# Altium project Discharge.PrjPcb
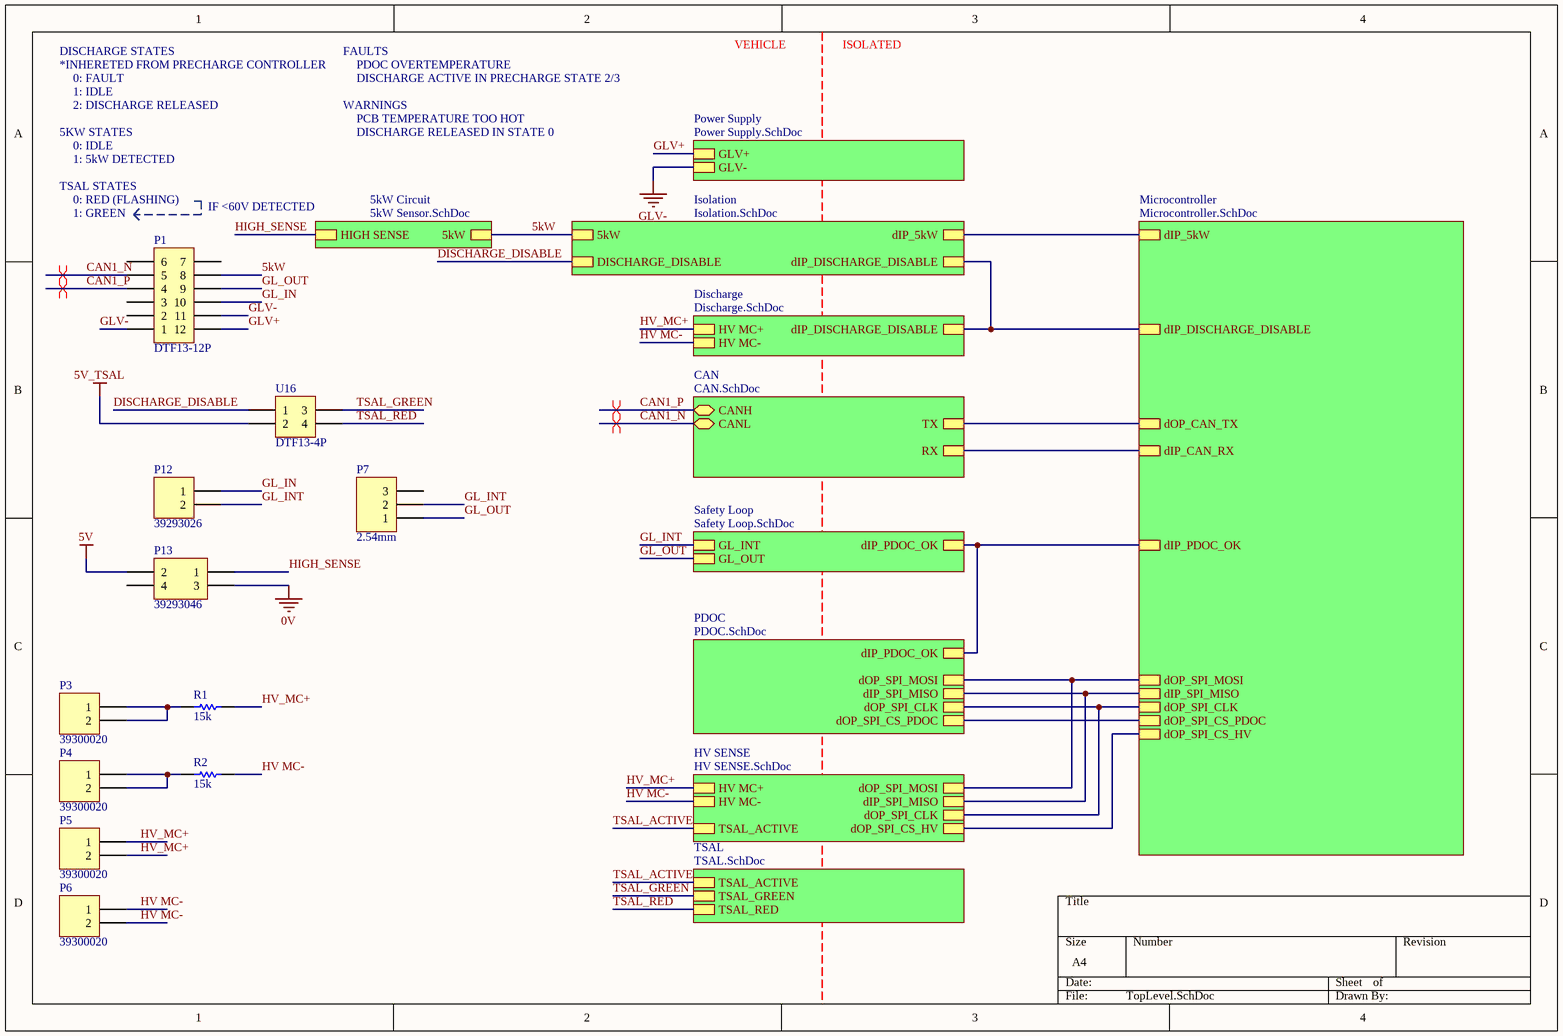
[diagram p0: TopLevel.SchDoc]
6 sheets, 90 parts. Net scope: hierarchical (ports join the sheet entries above them; power ports are global).
Board files: Discharge_B2.PcbDoc, Discharge_B3.PcbDoc, Discharge_B5.PcbDoc, Discharge_B4.PcbDoc, Discharge_C1.PcbDoc
Sheets:
  TopLevel.SchDoc
    Safety Loop = Safety Loop.SchDoc
    Discharge = Discharge.SchDoc
    PDOC = PDOC.SchDoc
    HV SENSE = HV Sense.SchDoc
    TSAL = TSAL.SchDoc

## Sheet TopLevel.SchDoc
size A4; SheetNumber: 1; SheetTotal: 11

### Parts
P1  DTF13-12P  [DTF13-12P]
P3  39300020  [39300020]
P4  39300020  [39300020]
P5  39300020  [39300020]
P6  39300020  [39300020]
P7  2.54mm  [TH 2.54mm Header 1x3]
P12  39293026  [39293026]
P13  39293046  [39293046]
R1  15k  [TE_SMF7]
R2  15k  [TE_SMF7]
U16  DTF13-4P  [DTF13-4P]

### Sub-sheets
5kW Circuit = 5kW Sensor.SchDoc (file not in this document): 5kW, HIGH SENSE
CAN = CAN.SchDoc (file not in this document): CANH (bidir), CANL (bidir), TX, RX
Discharge = Discharge.SchDoc: dIP_DISCHARGE_DISABLE, HV MC+, HV MC-
HV SENSE = HV SENSE.SchDoc: HV MC+, HV MC-, dOP_SPI_MOSI, dIP_SPI_MISO, dOP_SPI_CLK, dOP_SPI_CS_HV, TSAL_ACTIVE
Isolation = Isolation.SchDoc (file not in this document): dIP_DISCHARGE_DISABLE, DISCHARGE_DISABLE, 5kW, dIP_5kW
Microcontroller = Microcontroller.SchDoc (file not in this document): dIP_PDOC_OK, dIP_DISCHARGE_DISABLE, dIP_5kW, dOP_CAN_TX, dIP_CAN_RX, dOP_SPI_MOSI, dIP_SPI_MISO, dOP_SPI_CLK, dOP_SPI_CS_PDOC, dOP_SPI_CS_HV
PDOC = PDOC.SchDoc: dIP_PDOC_OK, dOP_SPI_CLK, dOP_SPI_MOSI, dIP_SPI_MISO, dOP_SPI_CS_PDOC
Power Supply = Power Supply.SchDoc (file not in this document): GLV+, GLV-
Safety Loop = Safety Loop.SchDoc: GL_INT, GL_OUT, dIP_PDOC_OK
TSAL = TSAL.SchDoc: TSAL_GREEN, TSAL_RED, TSAL_ACTIVE

### Nets
0V: P13.3
5V: P13.2
5V_TSAL: U16.2
GLV-: P1.1 P1.11 ; sheet Power Supply/GLV-
HV MC-: P6.1 P6.2 R2.2 ; sheet Discharge/HV MC-, sheet HV SENSE/HV MC-
5kW: P1.8 ; sheet Isolation/5kW, sheet 5kW Circuit/5kW
CAN1_N: P1.5 ; sheet CAN/CANL
CAN1_P: P1.4 ; sheet CAN/CANH
DISCHARGE_DISABLE: U16.1 ; sheet Isolation/DISCHARGE_DISABLE
GL_IN: P1.10 P12.1
GL_INT: P7.2 P12.2 ; sheet Safety Loop/GL_INT
GL_OUT: P1.9 P7.1 ; sheet Safety Loop/GL_OUT
GLV+: P1.12 ; sheet Power Supply/GLV+
HIGH_SENSE: P13.1 ; sheet 5kW Circuit/HIGH SENSE
HV_MC+: P5.1 P5.2 R1.2 ; sheet Discharge/HV MC+, sheet HV SENSE/HV MC+  [project net HV MC +]
TSAL_ACTIVE: sheet HV SENSE/TSAL_ACTIVE, sheet TSAL/TSAL_ACTIVE
TSAL_GREEN: U16.3 ; sheet TSAL/TSAL_GREEN
TSAL_RED: U16.4 ; sheet TSAL/TSAL_RED
NetD17_K: sheet PDOC/dIP_SPI_MISO, sheet HV SENSE/dIP_SPI_MISO, sheet Microcontroller/dIP_SPI_MISO
NetP3_1: P3.1 P3.2 R1.1
NetP4_1: P4.1 P4.2 R2.1
NetR9_1: sheet Safety Loop/dIP_PDOC_OK, sheet PDOC/dIP_PDOC_OK, sheet Microcontroller/dIP_PDOC_OK
NetR11_1: sheet Isolation/dIP_DISCHARGE_DISABLE, sheet Discharge/dIP_DISCHARGE_DISABLE, sheet Microcontroller/dIP_DISCHARGE_DISABLE
NetU9_3: sheet HV SENSE/dOP_SPI_CS_HV, sheet Microcontroller/dOP_SPI_CS_HV
NetU9_4: sheet PDOC/dOP_SPI_CLK, sheet HV SENSE/dOP_SPI_CLK, sheet Microcontroller/dOP_SPI_CLK
NetU9_5: sheet PDOC/dOP_SPI_MOSI, sheet HV SENSE/dOP_SPI_MOSI, sheet Microcontroller/dOP_SPI_MOSI
NetU13_3: sheet PDOC/dOP_SPI_CS_PDOC, sheet Microcontroller/dOP_SPI_CS_PDOC
(unnamed): sheet Isolation/dIP_5kW, sheet Microcontroller/dIP_5kW
(unnamed): sheet Microcontroller/dOP_CAN_TX, sheet CAN/TX
(unnamed): sheet Microcontroller/dIP_CAN_RX, sheet CAN/RX

Not connected (* = marked no-connect by the designer): P1 2 3 6 7; P7 3; P13 4

### Layout directives
differential pair: CAN1_N, CAN1_P

### Notes on the sheet
- DISCHARGE STATES
- *INHERETED FROM PRECHARGE CONTROLLER
- 0: FAULT
- 1: IDLE
- 2: DISCHARGE RELEASED
- FAULTS
- WARNINGS
- PDOC OVERTEMPERATURE
- DISCHARGE ACTIVE IN PRECHARGE STATE 2/3
- VEHICLE
- ISOLATED
- 5KW STATES
- 1: 5kW DETECTED
- 0: IDLE
- PCB TEMPERATURE TOO HOT
- DISCHARGE RELEASED IN STATE 0
- TSAL STATES
- 0: RED (FLASHING)
- (near P1) 1: GREEN
- (near P1) IF <60V DETECTED

### Library data of the parts
P1 = DTF13-12P: Positions: 12; Pitch: 4.45mm; Angle: 90; Flange: No; Contact: Copper Alloy; Part Number: DTF13-12P; Row Spacing: 4.45mm; Digikey Part Number: 1734-1861-ND; Digikey Link: https://www.digikey.com/products/en?keywords=dtf13-12pa
P3-P6 = 39300020: Pitch: 4.2mm; Row Spacing: 5.5mm; Angle: 90; Flange: No; Contact: Tin; Part Number: 39300020; Positions: 2; Digikey Part Number: WM21351-ND
P7 = TH 2.54mm Header 1x3: Positions: 3; Angle: 0; Flange: No; Contact: NA; Part Number: TH 2.54mm Header 1x3; Pitch: 2.54mm; Row Spacing: 2.54mm
P12 = 39293026: Pitch: 4.2mm; Row Spacing: 5.5mm; Angle: 0; Flange: No; Contact: Tin; Part Number: 39293026; Positions: 2; Digikey Part Number: WM3843-ND
P13 = 39293046: Pitch: 4.2mm; Row Spacing: 5.5mm; Angle: 0; Flange: No; Contact: Tin; Part Number: 39293046; Positions: 4; Digikey Part Number: WM3844-ND
R1 R2 = SMF715KJ: Manufacturer: TE; Tolerance: 0.05; Rated Power: 7W; Part Number: SMF715KJ; Value: 15k; Material: Metal Film
U16 = DTF13-4P: Positions: 4; Pitch: 9.12mm; Row Spacing: 4.45mm; Angle: 90; Flange: Yes; Contact: Copper Alloy; Part Number: DTF13-4P; Digikey Part Number: 1734-1646-ND; Digikey Link: https://www.digikey.com.au/products/en?keywords=dtf13-4p

## Sheet Safety Loop.SchDoc
size A4; SheetNumber: 4; SheetTotal: 11
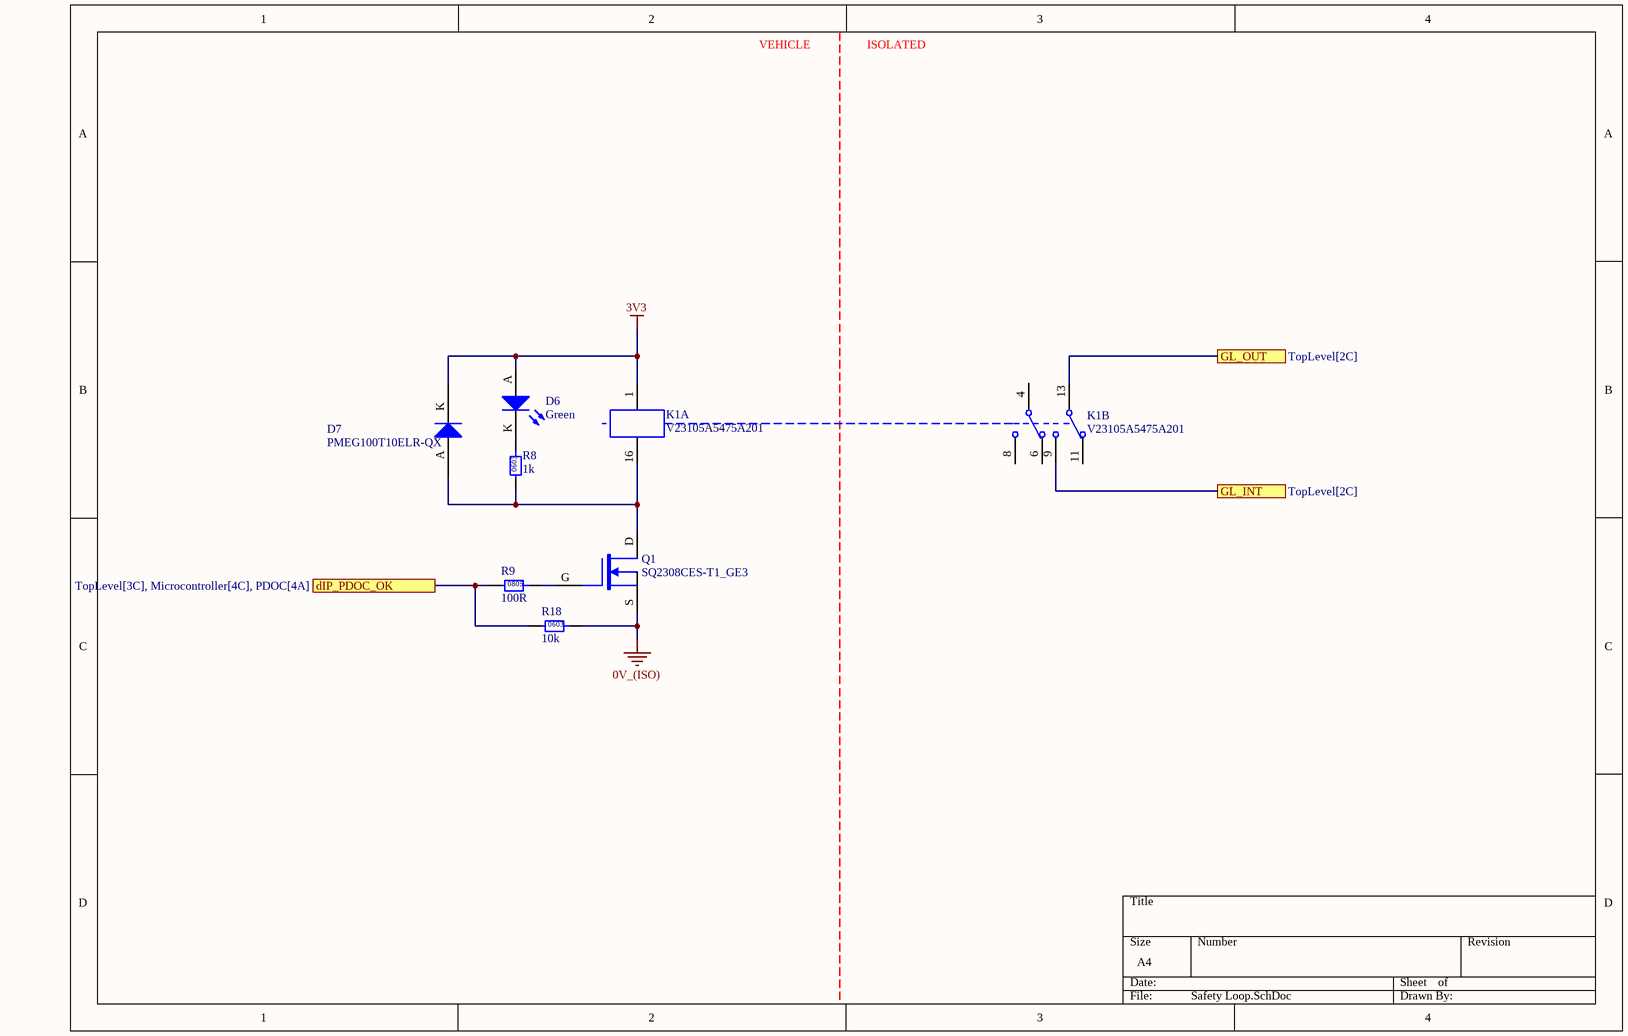
[diagram p1: Safety Loop.SchDoc]

### Parts
D6  Green  [0805 LED]
D7  PMEG100T10ELR-QX  [SODFL350X110-2N]
K1  V23105A5475A201  [TI 2-DIL]  (parts A,B of 2)
Q1  SQ2308CES-T1_GE3  [VSHY SOT-23-3]
R8  1k  [0603]
R9  100R  [0805]
R18  10k  [0603]

### Ports
dIP_PDOC_OK (see TopLevel[3C], Microcontroller[4C], PDOC[4A]), GL_INT (see TopLevel[2C]), GL_OUT (see TopLevel[2C])

### Nets
0V_(ISO): Q1.S R18.2
3V3: D6.A D7.K K1.1
GL_INT: K1.9 ; port GL_INT
GL_OUT: K1.13 ; port GL_OUT
NetD6_K: D6.K R8.2
NetD7_A: D7.A K1.16 Q1.D R8.1
NetQ1_G: Q1.G R9.2
NetR9_1: R9.1 R18.1 ; port dIP_PDOC_OK

Not connected (* = marked no-connect by the designer): K1 4 6 8 11

### Notes on the sheet
- VEHICLE
- ISOLATED
- (in symbol RC0603FR-071KL) 0603
- (in symbol RC0603FR-0710KL) 0603
- (in symbol RC0805FR07100RL) 0805

### Library data of the parts
D6 = SML-210FTT86: Green LED Indication - Discrete 1.75V 0805 (2012 Metric); Manufacturer: ROHM Semiconductor; Part Number: SML-210FTT86; Colour: Green; Digikey Part Number: 511-1285-1-ND
D7 = CMP-004-00005-4: Diode 100 V 1A Surface Mount SOD-123W
K1 = CMP-036-000001-1: 5V DPDT Relay 3A 220VDC; Part Number: V23105A5475A201
Q1 = SQ2308CES-T1_GE3: MOSFET N-CH 60V 2.3A SOT23; Manufacturer: Vishay Siliconix; Type: N-channel; Rated Power: 2W; Published: 24-Mar-1999; LatestRevisionDate: 29-May-2009; LatestRevisionNote: IPC-7351 Footprint Added.; PackageVersion: Sep-2000; PackageReference: SOT-343; Publisher: Altium Limited; PackageDescription: 4-Pin SOT-343 Package 1.3 mm Pitch, 2.1 mm Lead Span; Part Number: SQ2308CES-T1_GE3; Digikey Part Number: SQ2308CES-T1_GE3CT-ND
R8 = RC0603FR-071KL: Manufacturer: YAGEO; Tolerance: 0.01; Rated Power: 0.1W; Part Number: RC0603FR-071KL; Value: 1k; Digikey Part Number: 311-1.00KHRCT-ND; Material: FR-07
R9 = RC0805FR07100RL: Manufacturer: YAGEO; Tolerance: 0.01; Rated Power: 0.125W; Part Number: RC0805FR07100RL; Value: 100R; Material: FR-07; Digikey Part Number: 311-100CRCT-ND
R18 = RC0603FR-0710KL: Manufacturer: YAGEO; Tolerance: 0.01; Rated Power: 0.1W; Part Number: RC0603FR-0710KL; Value: 10k; Material: FR-07; Digikey Part Number: 311-10.0KHRCT-ND

## Sheet Discharge.SchDoc
size A4; SheetNumber: 5; SheetTotal: 11
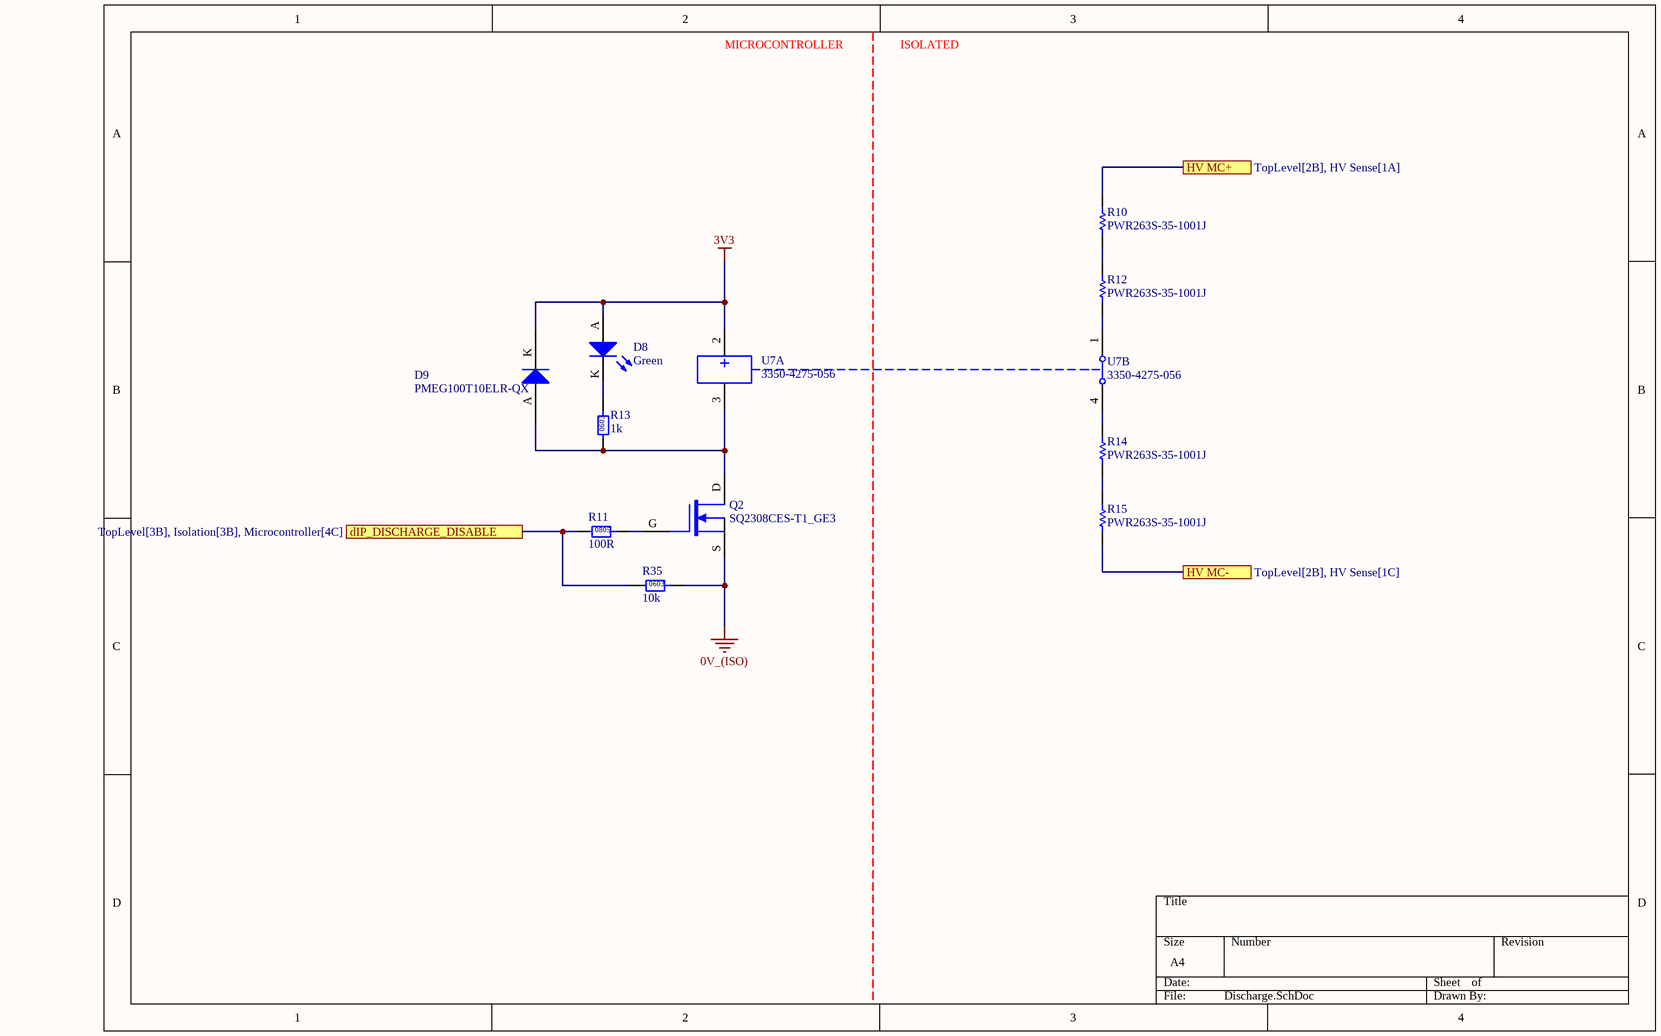
[diagram p2: Discharge.SchDoc]

### Parts
D8  Green  [0805 LED]
D9  PMEG100T10ELR-QX  [SODFL350X110-2N]
Q2  SQ2308CES-T1_GE3  [VSHY SOT-23-3]
R10  PWR263S-35-1001J  [B TO-263]
R11  100R  [0805]
R12  PWR263S-35-1001J  [B TO-263]
R13  1k  [0603]
R14  PWR263S-35-1001J  [B TO-263]
R15  PWR263S-35-1001J  [B TO-263]
R35  10k  [0603]
U7  3350-4275-056  [CI SPST]  (parts A,B of 2)

### Ports
dIP_DISCHARGE_DISABLE (see TopLevel[3B], Isolation[3B], Microcontroller[4C]), HV MC+ (see TopLevel[2B], HV Sense[1A]), HV MC- (see TopLevel[2B], HV Sense[1C])

### Nets
0V_(ISO): Q2.S R35.2
3V3: D8.A D9.K U7.2
HV MC-: R15.2 ; port HV MC-
HV MC +: R10.1 ; port HV MC+
NetD8_K: D8.K R13.2
NetD9_A: D9.A Q2.D R13.1 U7.3
NetQ2_G: Q2.G R11.2
NetR10_2: R10.2 R12.1
NetR11_1: R11.1 R35.1 ; port dIP_DISCHARGE_DISABLE
NetR12_2: R12.2 U7.1
NetR14_1: R14.1 U7.4
NetR14_2: R14.2 R15.1

### Notes on the sheet
- MICROCONTROLLER
- ISOLATED
- (in symbol RC0603FR-071KL) 0603
- (in symbol RC0603FR-0710KL) 0603
- (in symbol RC0805FR07100RL) 0805

### Library data of the parts
D8 = SML-210FTT86: as D6 on sheet Safety Loop; Part Number: SML-210FTT86; Colour: Green; Digikey Part Number: 511-1285-1-ND
D9 = CMP-004-00005-4: Diode 100 V 1A Surface Mount SOD-123W
Q2 = SQ2308CES-T1_GE3: as Q1 on sheet Safety Loop; Published: 24-Mar-1999; LatestRevisionDate: 29-May-2009; LatestRevisionNote: IPC-7351 Footprint Added.; PackageVersion: Sep-2000; PackageReference: SOT-343; Publisher: Altium Limited; PackageDescription: 4-Pin SOT-343 Package 1.3 mm Pitch, 2.1 mm Lead Span; Part Number: SQ2308CES-T1_GE3; Digikey Part Number: SQ2308CES-T1_GE3CT-ND
R10 R12 R14 R15 = CMP-037-000402-1: Manufacturer: Bournes Inc; Value: 1k; Rated Voltage: 35W; Tolerance: 0.05; Part Number: PWR263S-35-1001J; Digikey Part Number: PWR263S-35-1001J-ND
R11 = RC0805FR07100RL: as R9 on sheet Safety Loop; Part Number: RC0805FR07100RL; Value: 100R; Material: FR-07; Digikey Part Number: 311-100CRCT-ND
R13 = RC0603FR-071KL: as R8 on sheet Safety Loop; Part Number: RC0603FR-071KL; Value: 1k; Digikey Part Number: 311-1.00KHRCT-ND; Material: FR-07
R35 = RC0603FR-0710KL: as R18 on sheet Safety Loop; Part Number: RC0603FR-0710KL; Value: 10k; Material: FR-07; Digikey Part Number: 311-10.0KHRCT-ND
U7 = CMP-035-000005-1: RELAY REED HV SPST 200W 3A 5V (NC); Part Number: 3350-4275-056

## Sheet PDOC.SchDoc
size A4; SheetNumber: 8; SheetTotal: 11
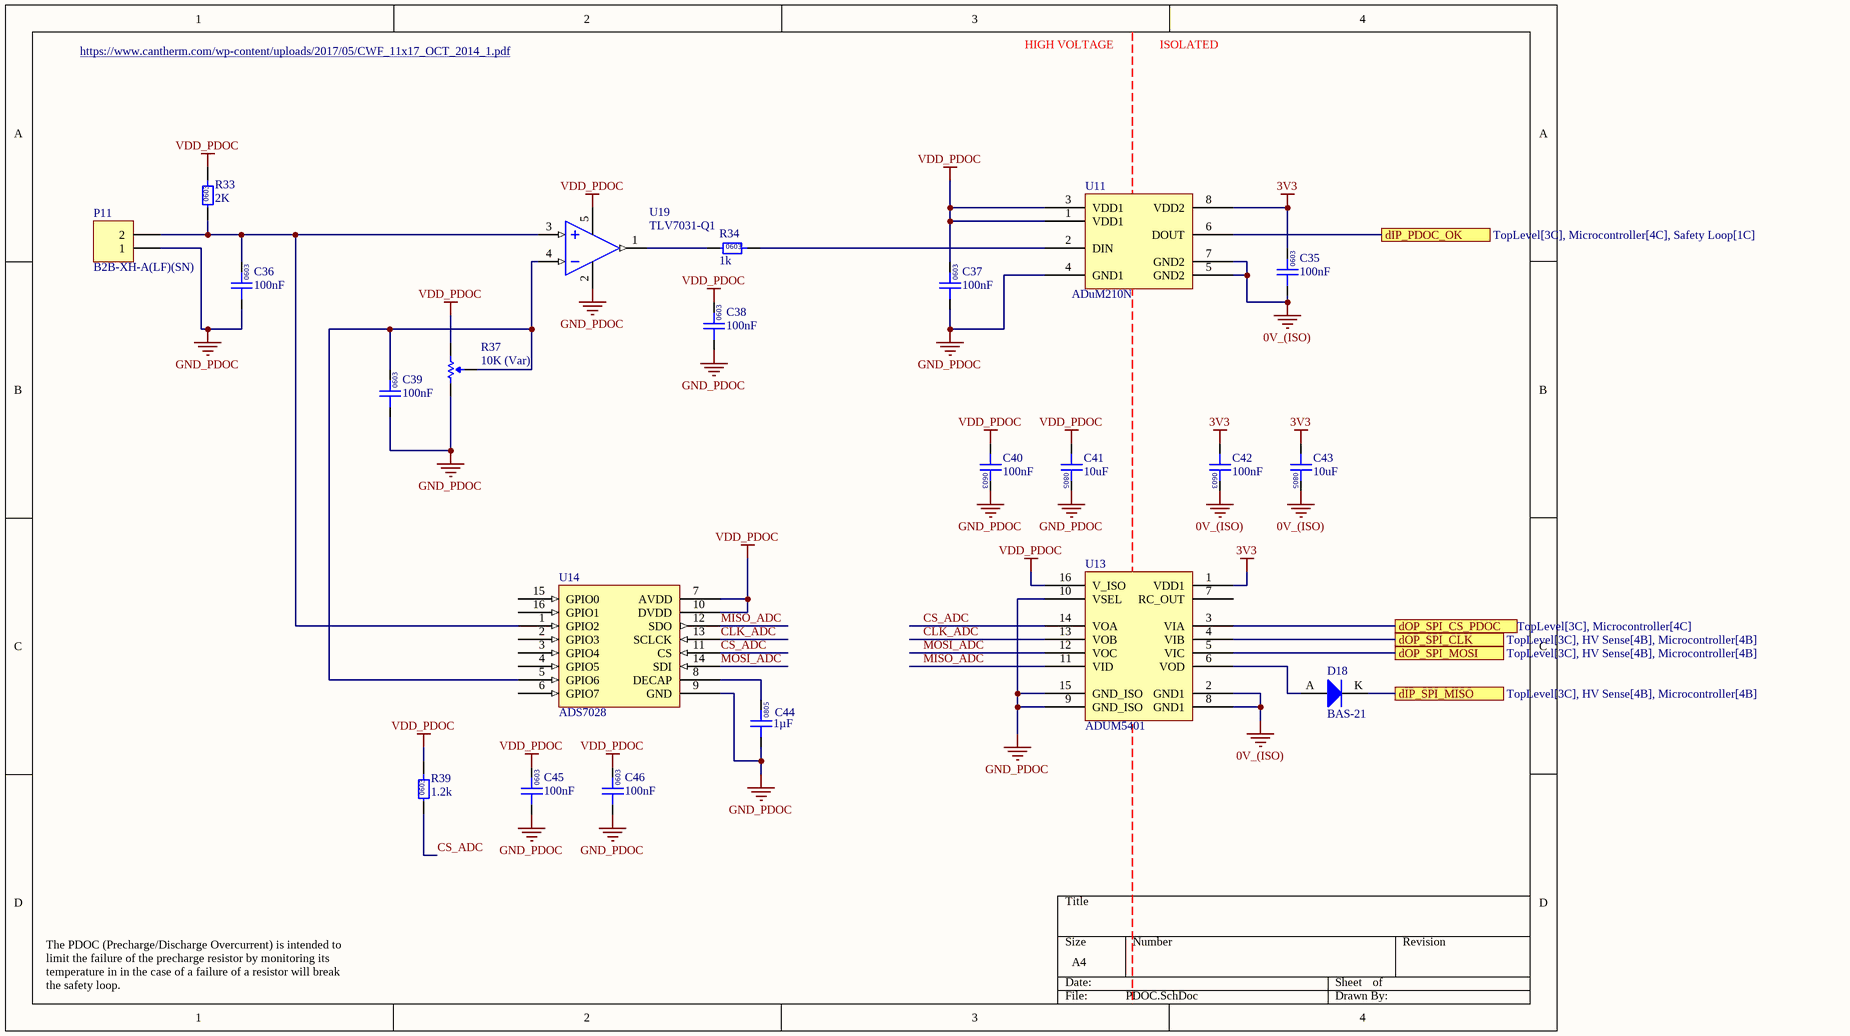
[diagram p3: PDOC.SchDoc]

### Parts
C35  100nF  [0603]
C36  100nF  [0603]
C37  100nF  [0603]
C38  100nF  [0603]
C39  100nF  [0603]
C40  100nF  [0603]
C41  10uF  [0805]
C42  100nF  [0603]
C43  10uF  [0805]
C44  1µF  [0805]
C45  100nF  [0603]
C46  100nF  [0603]
D18  BAS-21  [NEXPERIA_SOT23]
P11  B2B-XH-A(LF)(SN)  [XH 2 PIN VERT]
R33  2K  [0603]
R34  1k  [0603]
R37  10K (Var)  [B 3296]
R39  1.2k  [0603]
U11  ADuM210N  [SOIC-8W]
U13  ADUM5401  [AD 16-SOIC]
U14  ADS7028  [WFQN-16]
U19  TLV7031-Q1  [TI SOT-23-5]

### Ports
dIP_PDOC_OK (see TopLevel[3C], Microcontroller[4C], Safety Loop[1C]), dIP_SPI_MISO (see TopLevel[3C], HV Sense[4B], Microcontroller[4B]), dOP_SPI_CLK (see TopLevel[3C], HV Sense[4B], Microcontroller[4B]), dOP_SPI_CS_PDOC (see TopLevel[3C], Microcontroller[4C]), dOP_SPI_MOSI (see TopLevel[3C], HV Sense[4B], Microcontroller[4B])

### Nets
0V_(ISO): C35.1 C42.2 C43.2 U11.5(GND2) U11.7(GND2) U13.2(GND1) U13.8(GND1)
3V3: C35.2 C42.1 C43.1 U11.8(VDD2) U13.1(VDD1)
GND_PDOC: C36.1 C37.1 C38.1 C39.1 C40.2 C41.2 C44.1 C45.1 C46.1 P11.1 R37.3(CW) U11.4(GND1) U13.9(GND_ISO) U13.10(VSEL) U13.15(GND_ISO) U14.9(GND) U19.2(V-)
VDD_PDOC: C37.2 C38.2 C40.1 C41.1 C45.2 C46.2 R33.2 R37.1(CCW) R39.2 U11.1(VDD1) U11.3(VDD1) U13.16(V_ISO) U14.7(AVDD) U14.10(DVDD) U19.5(Vcc)
CLK_ADC: U13.13(VOB) U14.13(SCLCK)
CS_ADC: R39.1 U13.14(VOA) U14.11(CS)
MISO_ADC: U13.11(VID) U14.12(SDO)
MOSI_ADC: U13.12(VOC) U14.14(SDI)
NetC36_2: C36.2 P11.2 R33.1 U14.1(GPIO2) U19.3(IN+)
NetC39_2: C39.2 R37.2(Wiper) U14.5(GPIO6) U19.4(IN-)
NetC44_2: C44.2 U14.8(DECAP)
NetD17_K: D18.K ; port dIP_SPI_MISO
NetD18_A: D18.A U13.6(VOD)
NetR9_1: U11.6(DOUT) ; port dIP_PDOC_OK
NetR34_1: R34.1 U19.1(OUT)
NetR34_2: R34.2 U11.2(DIN)
NetU9_4: U13.4(VIB) ; port dOP_SPI_CLK
NetU9_5: U13.5(VIC) ; port dOP_SPI_MOSI
NetU13_3: U13.3(VIA) ; port dOP_SPI_CS_PDOC

Not connected (* = marked no-connect by the designer): U13 7(RC_OUT); U14 2(GPIO3) 3(GPIO4) 4(GPIO5) 6(GPIO7) 15(GPIO0) 16(GPIO1)

### Notes on the sheet
- https://www.cantherm.com/wp-content/uploads/2017/05/CWF_11x17_OCT_2014_1.pdf
- HIGH VOLTAGE
- ISOLATED
- The PDOC (Precharge/Discharge Overcurrent) is intended to limit the failure of the precharge resistor by monitoring its temperature in in the case of a failure of a resistor will break the safety loop.
- (in symbol GCM21BR71H105KA03L) 0805
- (in symbol GCM188L81H104KA57D) 0603
- (in symbol GRM21BR6YA106KE43L) 0805
- (in symbol RC0603FR-071KL) 0603
- (in symbol RC0603FR-072KL) 0603
- (in symbol RC0603JR-071K2L) 0603

### Library data of the parts
C35-C40 C42 C45 C46 = GCM188L81H104KA57D: Manufacturer: muRata; Rated Voltage: 50V; Tolerance: ±10%; Material: MLCC; Temperature Rating: X8L; Part Number: GCM188L81H104KA57D; Value: 100nF; Digikey Part Number: 490-6049-1-ND
C41 C43 = GRM21BR6YA106KE43L: Manufacturer: muRata; Rated Voltage: 50V; Tolerance: 10%; Material: MLCC; Temperature Rating: X5R; Part Number: GRM21BR6YA106KE43L; Value: 10uF; Digikey Part Number: 490-10514-6-ND
C44 = GCM21BR71H105KA03L: Manufacturer: muRata; Rated Voltage: 50V; Tolerance: ±10%; Material: MLCC; Temperature Rating: X7R; Part Number: GCM21BR71H105KA03L; Value: 1µF; Digikey Part Number: 490-10675-1-ND
D18 = BAS-21: Manufacturer: Nexperia USA Inc.; Forward Voltage: 1.0V; Breakdown Voltage: 250V; Rated Power: 250mW; Part Number: BAS-21
P11 = B2B-XH-A(LF)(SN): Positions: 2; Pitch: 2.54mm; Angle: 0; Flange: No; Contact: Tin; Part Number: B2B-XH-A(LF)(SN); Row Spacing: 2.54mm; Digikey Part Number: 455-2247-ND; Digikey Link: https://www.digikey.com.au/en/products/detail/jst-sales-america-inc/B2B-XH-A-LF-SN/1651045
R33 = RC0603FR-072KL: Manufacturer: YAGEO; Tolerance: 0.01; Rated Power: 0.1W; Part Number: RC0603FR-072KL; Value: 2K; Digikey Part Number: 311-2.00KHRCT-ND; Material: FR-07
R34 = RC0603FR-071KL: as R8 on sheet Safety Loop; Part Number: RC0603FR-071KL; Value: 1k; Digikey Part Number: 311-1.00KHRCT-ND; Material: FR-07
R37 = 3296W-1-103LF: Manufacturer: Bournes Inc; Tolerance: 0.1; Rated Power: 0.5W; Part Number: 3296W-1-103LF; Value: 10K (Var); Digikey Part Number: 3296W-103LF-ND
R39 = RC0603JR-071K2L: Manufacturer: YAGEO; Tolerance: 0.01; Rated Power: 0.1W; Part Number: RC0603JR-071K2L; Value: 1.2k; Material: FR-07; Digikey Part Number: 311-1.2KGRCT-ND
U11 = CMP-110-000007-1: DIGITAL ISOLATOR, SINGLE CHANNEL; Digikey Link: #https://www.analog.com/media/en/technical-documentation/data-sheets/ADuM210N.pdf#; Part Number: ADuM210N
U13 = ADUM5401: Quad Channel 2.5kV Digital Isolator with isoPower; Manufacturer: Analogue Devices; Part Number: ADUM5401
U14 = ADS7028IRTER: IC ADC 12BIT SAR 16WQFN; Manufacturer: Texas Instruments; Part Number: ADS7028IRTER; Digikey Part Number: ADS7028IRTER; Digikey Link: https://www.digikey.com.au/en/products/detail/texas-instruments/ADS7028IRTER/12696020?s=N4IgTCBcDaIIIBEDKB2ADGAHASQEoBUBRXEAXQF8g
U19 = TLV7031-Q1: Manufacturer: Texas Instruments; Input Voltage: 1.6 to 6.5 V; Channels: 1; Output: Push-Pull; Part Number: TLV7031-Q1; Digikey Part Number: 296-TLV7031QDBVRQ1CT-ND

## Sheet HV Sense.SchDoc
size A4; SheetNumber: 7; SheetTotal: 11
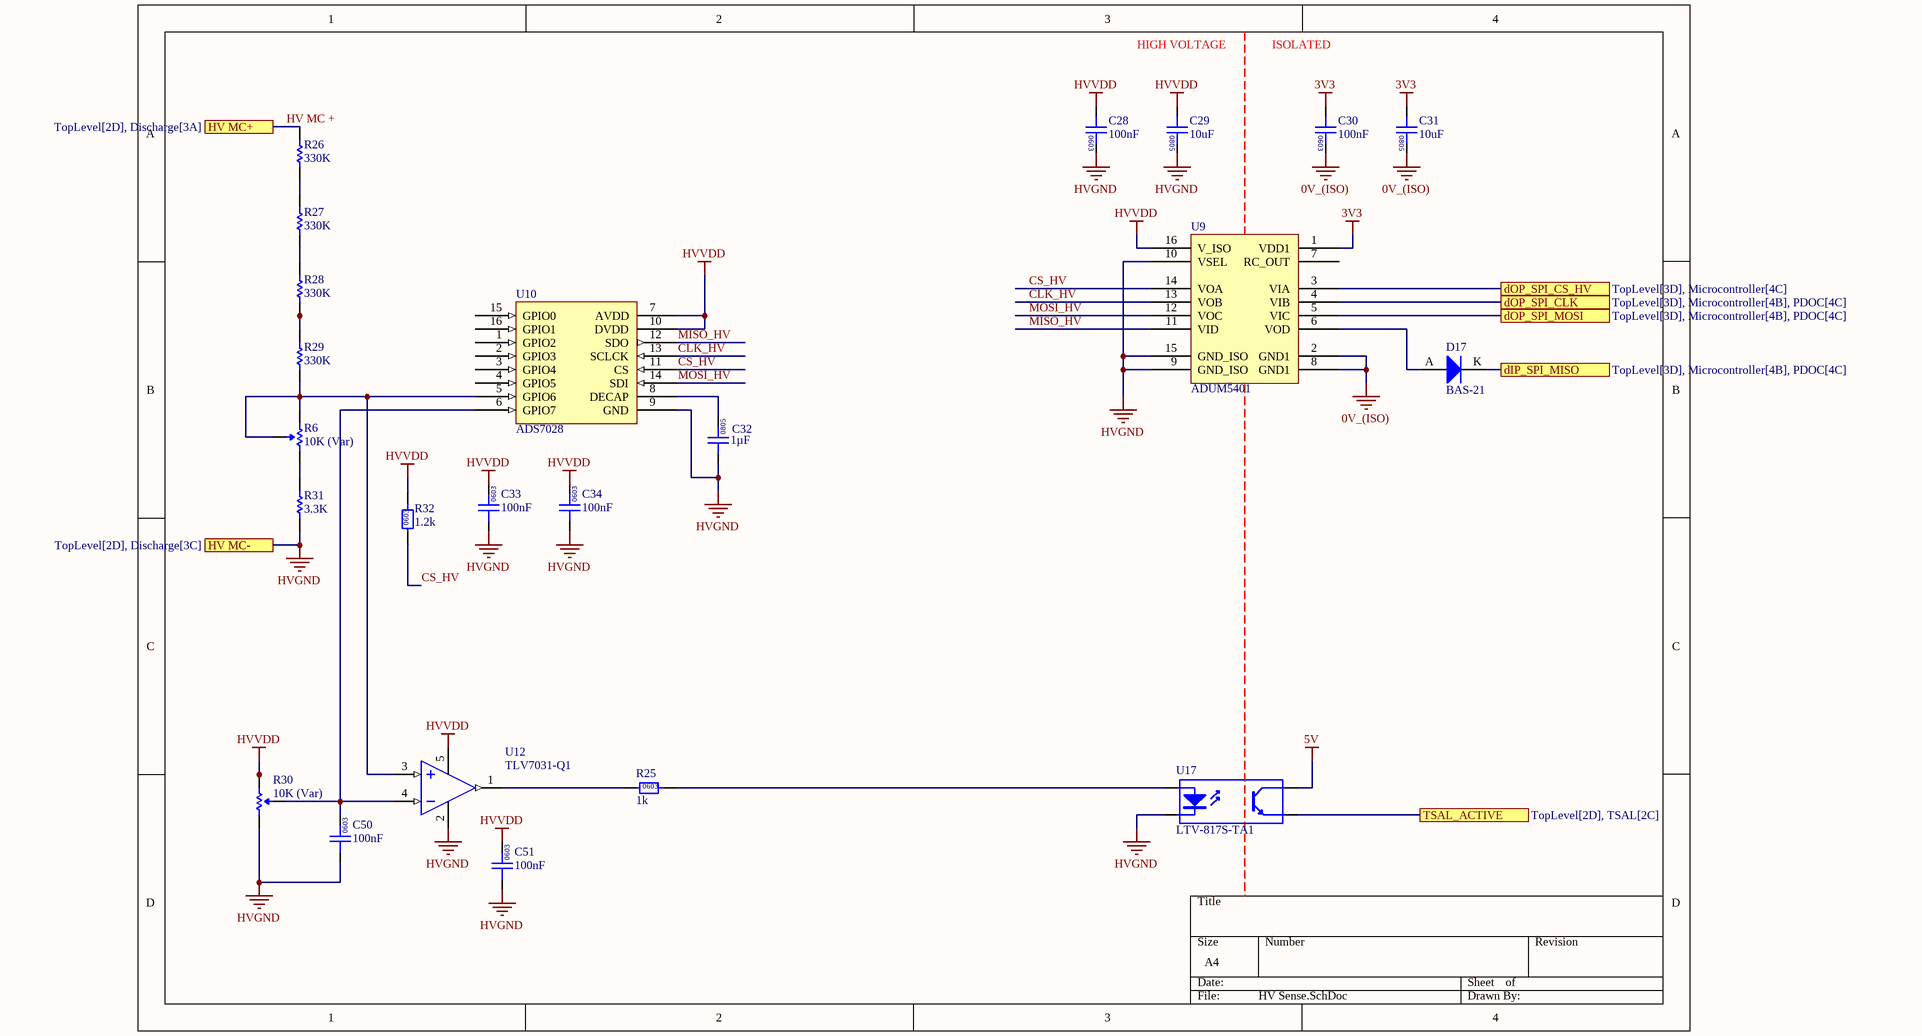
[diagram p4: HV Sense.SchDoc]

### Parts
C28  100nF  [0603]
C29  10uF  [0805]
C30  100nF  [0603]
C31  10uF  [0805]
C32  1µF  [0805]
C33  100nF  [0603]
C34  100nF  [0603]
C50  100nF  [0603]
C51  100nF  [0603]
D17  BAS-21  [NEXPERIA_SOT23]
R6  10K (Var)  [B 3296]
R25  1k  [0603]
R26  330K  [VB 0207]
R27  330K  [VB 0207]
R28  330K  [VB 0207]
R29  330K  [VB 0207]
R30  10K (Var)  [B 3296]
R31  3.3K  [VB 0207]
R32  1.2k  [0603]
U9  ADUM5401  [AD 16-SOIC]
U10  ADS7028  [WFQN-16]
U12  TLV7031-Q1  [TI SOT-23-5]
U17  LTV-817S-TA1  [ON 4-SMD]

### Ports
dIP_SPI_MISO (see TopLevel[3D], Microcontroller[4B], PDOC[4C]), dOP_SPI_CLK (see TopLevel[3D], Microcontroller[4B], PDOC[4C]), dOP_SPI_CS_HV (see TopLevel[3D], Microcontroller[4C]), dOP_SPI_MOSI (see TopLevel[3D], Microcontroller[4B], PDOC[4C]), HV MC+ (see TopLevel[2D], Discharge[3A]), HV MC- (see TopLevel[2D], Discharge[3C]), TSAL_ACTIVE (see TopLevel[2D], TSAL[2C])

### Nets
0V_(ISO): C30.2 C31.2 U9.2(GND1) U9.8(GND1)
3V3: C30.1 C31.1 U9.1(VDD1)
5V: U17.4(C)
HVGND: C28.2 C29.2 C32.1 C33.1 C34.1 C50.1 C51.1 R30.3(CW) R31.1 U9.9(GND_ISO) U9.10(VSEL) U9.15(GND_ISO) U10.9(GND) U12.2(V-) U17.2(K) ; port HV MC-  [project net HV MC-]
HVVDD: C28.1 C29.1 C33.2 C34.2 C51.2 R30.1(CCW) R32.2 U9.16(V_ISO) U10.7(AVDD) U10.10(DVDD) U12.5(Vcc)
CLK_HV: U9.13(VOB) U10.13(SCLCK)
CS_HV: R32.1 U9.14(VOA) U10.11(CS)
HV MC +: R26.2 ; port HV MC+
MISO_HV: U9.11(VID) U10.12(SDO)
MOSI_HV: U9.12(VOC) U10.14(SDI)
TSAL_ACTIVE: U17.3(E) ; port TSAL_ACTIVE
NetC32_2: C32.2 U10.8(DECAP)
NetC50_2: C50.2 R30.2(Wiper) U10.6(GPIO7) U12.4(IN-)
NetD17_A: D17.A U9.6(VOD)
NetD17_K: D17.K ; port dIP_SPI_MISO
NetR6_1: R6.1(CCW) R31.2
NetR6_2: R6.2(Wiper) R6.3(CW) R29.1 U10.5(GPIO6) U12.3(IN+)
NetR25_1: R25.1 U12.1(OUT)
NetR25_2: R25.2 U17.1(A)
NetR26_1: R26.1 R27.2
NetR27_1: R27.1 R28.2
NetR28_1: R28.1 R29.2
NetU9_3: U9.3(VIA) ; port dOP_SPI_CS_HV
NetU9_4: U9.4(VIB) ; port dOP_SPI_CLK
NetU9_5: U9.5(VIC) ; port dOP_SPI_MOSI

Not connected (* = marked no-connect by the designer): U9 7(RC_OUT); U10 1(GPIO2) 2(GPIO3) 3(GPIO4) 4(GPIO5) 15(GPIO0) 16(GPIO1)

### Notes on the sheet
- HIGH VOLTAGE
- ISOLATED
- (in symbol GCM21BR71H105KA03L) 0805
- (in symbol GCM188L81H104KA57D) 0603
- (in symbol GRM21BR6YA106KE43L) 0805
- (in symbol RC0603FR-071KL) 0603
- (in symbol RC0603JR-071K2L) 0603

### Library data of the parts
C28 C30 C33 C34 C50 C51 = GCM188L81H104KA57D: as C35 on sheet PDOC; Part Number: GCM188L81H104KA57D; Value: 100nF; Digikey Part Number: 490-6049-1-ND
C29 C31 = GRM21BR6YA106KE43L: as C41 on sheet PDOC; Part Number: GRM21BR6YA106KE43L; Value: 10uF; Digikey Part Number: 490-10514-6-ND
C32 = GCM21BR71H105KA03L: as C44 on sheet PDOC; Part Number: GCM21BR71H105KA03L; Value: 1µF; Digikey Part Number: 490-10675-1-ND
D17 = BAS-21: as D18 on sheet PDOC; Part Number: BAS-21
R6 R30 = 3296W-1-103LF: as R37 on sheet PDOC; Part Number: 3296W-1-103LF; Value: 10K (Var); Digikey Part Number: 3296W-103LF-ND
R25 = RC0603FR-071KL: as R8 on sheet Safety Loop; Part Number: RC0603FR-071KL; Value: 1k; Digikey Part Number: 311-1.00KHRCT-ND; Material: FR-07
R26-R29 = MMB02070C3303FB200: Manufacturer: Vishay Beyschlag; Tolerance: 0.01; Rated Power: 1W; Part Number: MMB02070C3303FB200; Value: 330K; Digikey Part Number: MMB-330KBCT-ND
R31 = MMB02070C3301FB200: Manufacturer: Vishay Beyschlag; Tolerance: 0.01; Rated Voltage: 1W; Part Number: MMB02070C3301FB200; Value: 3.3K; Digikey Part Number: MMB-3.30KBCT-ND
R32 = RC0603JR-071K2L: as R39 on sheet PDOC; Part Number: RC0603JR-071K2L; Value: 1.2k; Material: FR-07; Digikey Part Number: 311-1.2KGRCT-ND
U9 = ADUM5401: as U13 on sheet PDOC; Part Number: ADUM5401
U10 = ADS7028IRTER: as U14 on sheet PDOC; Part Number: ADS7028IRTER; Digikey Part Number: ADS7028IRTER; Digikey Link: https://www.digikey.com.au/en/products/detail/texas-instruments/ADS7028IRTER/12696020?s=N4IgTCBcDaIIIBEDKB2ADGAHASQEoBUBRXEAXQF8g
U12 = TLV7031-Q1: as U19 on sheet PDOC; Part Number: TLV7031-Q1; Digikey Part Number: 296-TLV7031QDBVRQ1CT-ND
U17 = LTV-817S-TA1: 35V 50ma Optocoupler (VF=1.2V); Manufacturer: Lite-On Inc; Part Number: LTV-817S-TA1; Digikey Part Number: 160-1893-2-ND; Digikey Link: https://www.digikey.com/product-detail/en/lite-on-inc/LTV-817S-TA1/160-1893-2-ND/388451

## Sheet TSAL.SchDoc
size A3; SheetNumber: 11; SheetTotal: 11
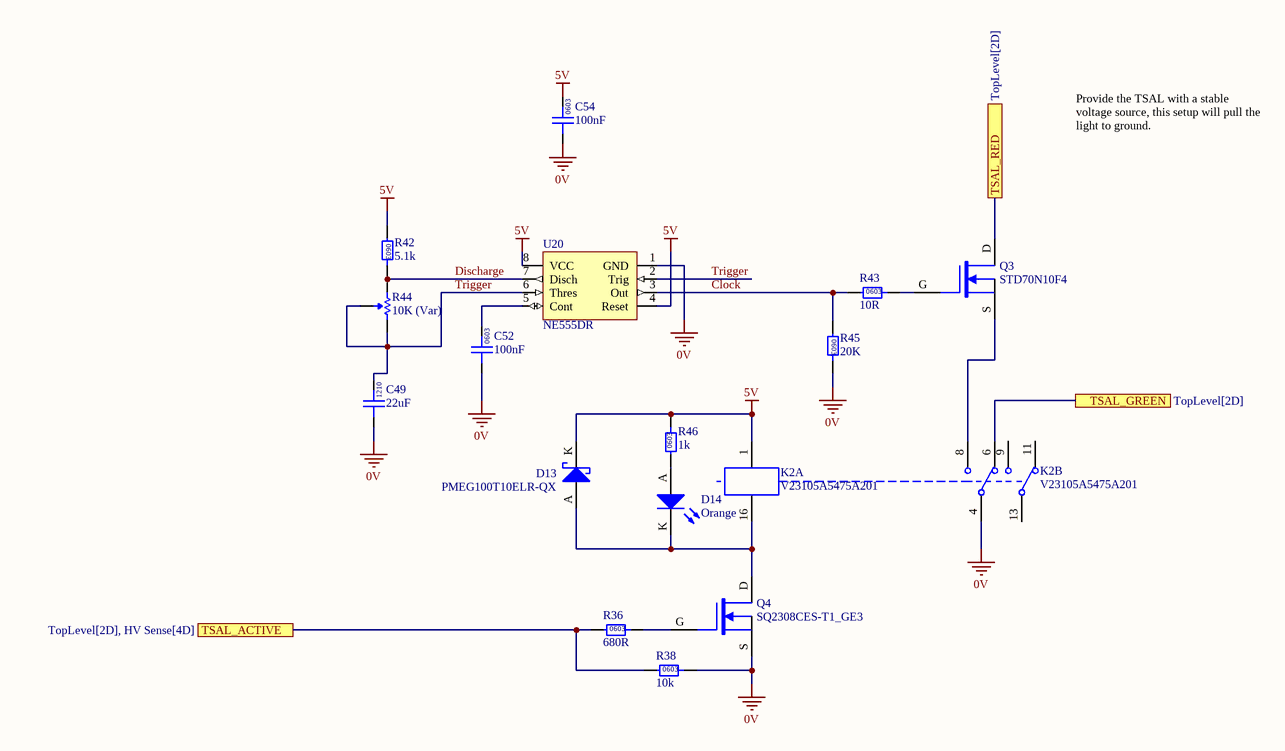
[diagram p5: TSAL.SchDoc]

### Parts
C49  22uF  [1210]
C52  100nF  [0603]
C54  100nF  [0603]
D13  PMEG100T10ELR-QX  [NXP SOD123W]
D14  Orange  [0805 LED]
K2  V23105A5475A201  [TI 2-DIL]  (parts A,B of 2)
Q3  STD70N10F4  [STM TO-252 MOSFET]
Q4  SQ2308CES-T1_GE3  [VSHY SOT-23-3]
R36  680R  [0603]
R38  10k  [0603]
R42  5.1k  [0603]
R43  10R  [0603]
R44  10K (Var)  [B 3296]
R45  20K  [0603]
R46  1k  [0603]
U20  NE555DR  [TI 8-SOIC]

### Ports
TSAL_ACTIVE (see TopLevel[2D], HV Sense[4D]), TSAL_GREEN (see TopLevel[2D]), TSAL_RED (see TopLevel[2D])

### Nets
0V: C49.1 C52.1 C54.1 K2.4 Q4.S R38.2 R45.2 U20.1(GND)
5V: C54.2 D13.K K2.1 R42.1 R46.2 U20.4(Reset) U20.8(VCC)
Clock: R43.1 R45.1 U20.3(Out)
Discharge: R42.2 R44.3(CW) U20.7(Disch)
Trigger: C49.2 R44.1(CCW) R44.2(Wiper) U20.2(Trig) U20.6(Thres)
TSAL_ACTIVE: R36.1 R38.1 ; port TSAL_ACTIVE
TSAL_GREEN: K2.6 ; port TSAL_GREEN
TSAL_RED: Q3.D ; port TSAL_RED
NetC52_2: C52.2 U20.5(Cont)
NetD13_A: D13.A D14.K K2.16 Q4.D
NetD14_A: D14.A R46.1
NetK2_8: K2.8 Q3.S
NetQ3_G: Q3.G R43.2
NetQ4_G: Q4.G R36.2

Not connected (* = marked no-connect by the designer): K2 9 11 13

### Notes on the sheet
- Provide the TSAL with a stable voltage source, this setup will pull the light to ground.
- Section Leader Check:
- Date:
- Title:
- Revision
- Variant
- Project:
- Engineers:
- Sheet
- of
- (in symbol GCM188L81H104KA57D) 0603
- (in symbol GRM32ER71E226KE15L) 1210
- (in symbol RC0603FR-071KL) 0603
- (in symbol RC0603FR-0710KL) 0603
- (in symbol RC0603FR-0710RL) 0603
- (in symbol RC0603FR-0720KL) 0603
- (in symbol RC0603JR-075K1L) 0603
- (in symbol RC0603JR-13680RL) 0603

### Library data of the parts
C49 = GRM32ER71E226KE15L: Manufacturer: Murata Electronics; Rated Voltage: 25V; Tolerance: ±10%; Material: MLCC; Temperature Rating: X7R; Part Number: GRM32ER71E226KE15L; Value: 22uF; Digikey Part Number: 490-5313-2-ND
C52 C54 = GCM188L81H104KA57D: as C35 on sheet PDOC; Part Number: GCM188L81H104KA57D; Value: 100nF; Digikey Part Number: 490-6049-1-ND
D13 = PMEG100T10ELR-QX: Manufacturer: Nexperia USA Inc.; Forward Voltage: 0.75 V @ 1A; Breakdown Voltage: 100 V; Rated Power: 680 mW; Part Number: PMEG100T10ELR-QX; Digikey Part Number: 1727-PMEG100T10ELR-QXCT-ND
D14 = SML-211DTT86: Orange LED Indication - Discrete 1.75V 0805 (2012 Metric); Manufacturer: ROHM Semiconductor; Part Number: SML-211DTT86; Colour: Orange; Digikey Part Number: 511-1291-1-ND
K2 = CMP-036-000001-1: 5V DPDT Relay 3A 220VDC; Part Number: V23105A5475A201
Q3 = STD70N10F4: N-Channel 100V 60A (Tc) 125W (Tc) Surface Mount DPAK; Manufacturer: STMicroelectronics; Published: 24-Mar-1999; LatestRevisionDate: 29-May-2009; LatestRevisionNote: IPC-7351 Footprint Added.; PackageVersion: Sep-2000; PackageReference: SOT-343; Publisher: Altium Limited; PackageDescription: 4-Pin SOT-343 Package 1.3 mm Pitch, 2.1 mm Lead Span; Part Number: STD70N10F4; Type: N-channel; Rated Power: 125W; Digikey Part Number: 497-8806-2-ND
Q4 = SQ2308CES-T1_GE3: as Q1 on sheet Safety Loop; Published: 24-Mar-1999; LatestRevisionDate: 29-May-2009; LatestRevisionNote: IPC-7351 Footprint Added.; PackageVersion: Sep-2000; PackageReference: SOT-343; Publisher: Altium Limited; PackageDescription: 4-Pin SOT-343 Package 1.3 mm Pitch, 2.1 mm Lead Span; Part Number: SQ2308CES-T1_GE3; Digikey Part Number: SQ2308CES-T1_GE3CT-ND
R36 = RC0603JR-13680RL: Manufacturer: YAGEO; Tolerance: 0.01; Rated Power: 0.1W; Part Number: RC0603JR-13680RL; Value: 680R; Material: FR-07; Digikey Part Number: 13-RC0603JR-13680RLCT-ND
R38 = RC0603FR-0710KL: as R18 on sheet Safety Loop; Part Number: RC0603FR-0710KL; Value: 10k; Material: FR-07; Digikey Part Number: 311-10.0KHRCT-ND
R42 = RC0603JR-075K1L: Manufacturer: YAGEO; Tolerance: 0.01; Rated Power: 0.1W; Part Number: RC0603JR-075K1L; Value: 5.1k; Material: FR-07; Digikey Part Number: 311-5.1KGRCT-ND
R43 = RC0603FR-0710RL: Manufacturer: YAGEO; Tolerance: 0.01; Rated Power: 0.1W; Part Number: RC0603FR-0710RL; Value: 10R; Material: FR-07; Digikey Part Number: 311-10.0HRCT-ND
R44 = 3296W-1-103LF: as R37 on sheet PDOC; Part Number: 3296W-1-103LF; Value: 10K (Var); Digikey Part Number: 3296W-103LF-ND
R45 = RC0603FR-0720KL: Manufacturer: YAGEO; Tolerance: 0.01; Rated Power: 0.1W; Part Number: RC0603FR-0720KL; Value: 20K; Material: FR-07; Digikey Part Number: 311-20.0KHRCT-ND
R46 = RC0603FR-071KL: as R8 on sheet Safety Loop; Part Number: RC0603FR-071KL; Value: 1k; Material: FR-07; Digikey Part Number: 311-1.00KHRCT-ND
U20 = CMP-022-000003-1: IC OSC SGL TIMER 100KHZ 8-SOIC; Part Number: NE555DR

## Nets that join several sheets
0V: TopLevel (P13.3), TSAL (8 pins)
0V_(ISO): Safety Loop (Q1.S R18.2), Discharge (Q2.S R35.2), PDOC (7 pins), HV Sense (C30.2 C31.2 U9.2 U9.8)
3V3: Safety Loop (D6.A D7.K K1.1), Discharge (D8.A D9.K U7.2), PDOC (5 pins), HV Sense (C30.1 C31.1 U9.1)
5V: TopLevel (P13.2), HV Sense (U17.4), TSAL (7 pins)
HV MC-: TopLevel (P6.1 P6.2 R2.2), Discharge (R15.2), HV Sense (15 pins)
GL_INT: TopLevel (P7.2 P12.2), Safety Loop (K1.9)
GL_OUT: TopLevel (P1.9 P7.1), Safety Loop (K1.13)
HV MC +: TopLevel (P5.1 P5.2 R1.2), Discharge (R10.1), HV Sense (R26.2)
NetD17_K: PDOC (D18.K), HV Sense (D17.K)
NetR9_1: Safety Loop (R9.1 R18.1), PDOC (U11.6)
NetU9_4: PDOC (U13.4), HV Sense (U9.4)
NetU9_5: PDOC (U13.5), HV Sense (U9.5)
TSAL_ACTIVE: HV Sense (U17.3), TSAL (R36.1 R38.1)
TSAL_GREEN: TopLevel (U16.3), TSAL (K2.6)
TSAL_RED: TopLevel (U16.4), TSAL (Q3.D)